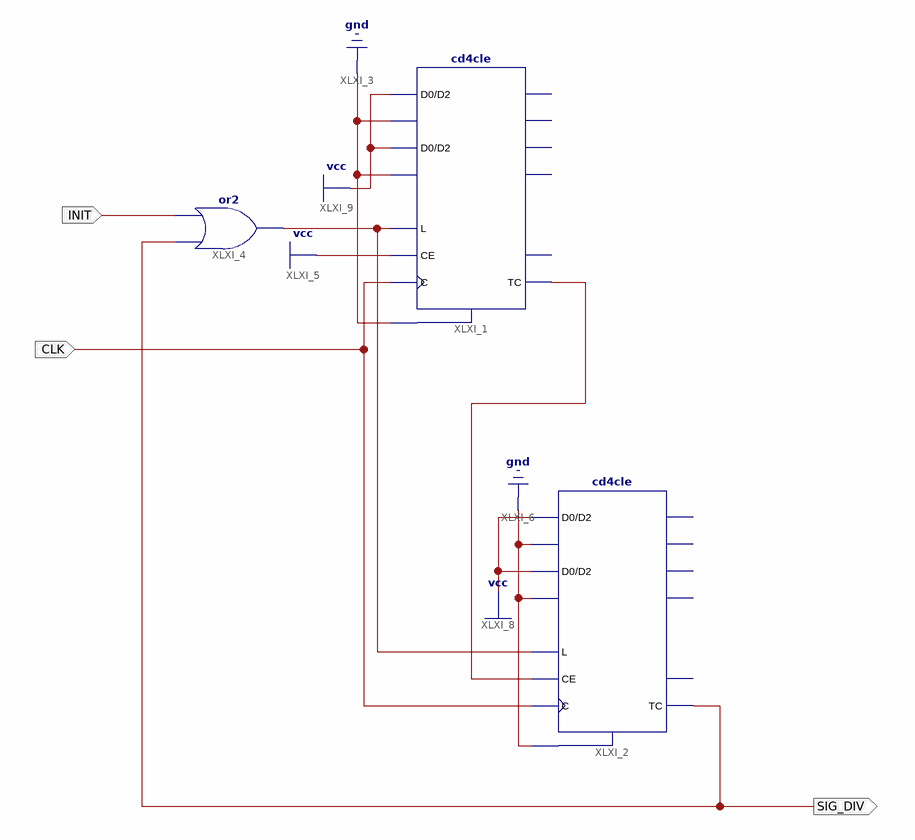
[diagram p0: schematic sheet 1]
// Xilinx ISE schematic p3ej3.sch (spartan3) as structural Verilog: 3 symbols, 3 ports
module p3ej3 (
  input  CLK,
  input  INIT,
  output SIG_DIV
);

  wire XLXN_5, XLXN_19;

  cd4cle XLXI_1 (
    .C(CLK), .CE(1'b1), .CLR(1'b0), .D0(1'b1), .D1(1'b0), .D2(1'b1), .D3(1'b0), .L(XLXN_19), .TC(XLXN_5));  // open: CEO, Q0, Q1, Q2, Q3
  cd4cle XLXI_2 (
    .C(CLK), .CE(XLXN_5), .CLR(1'b0), .D0(1'b1), .D1(1'b0), .D2(1'b1), .D3(1'b0), .L(XLXN_19), .TC(SIG_DIV));  // open: CEO, Q0, Q1, Q2, Q3
  or XLXI_4 (XLXN_19, SIG_DIV, INIT);
endmodule
